# Altium schematic sheet UpStream.SchDoc
size A; SheetNumber: 4; SheetTotal: 4
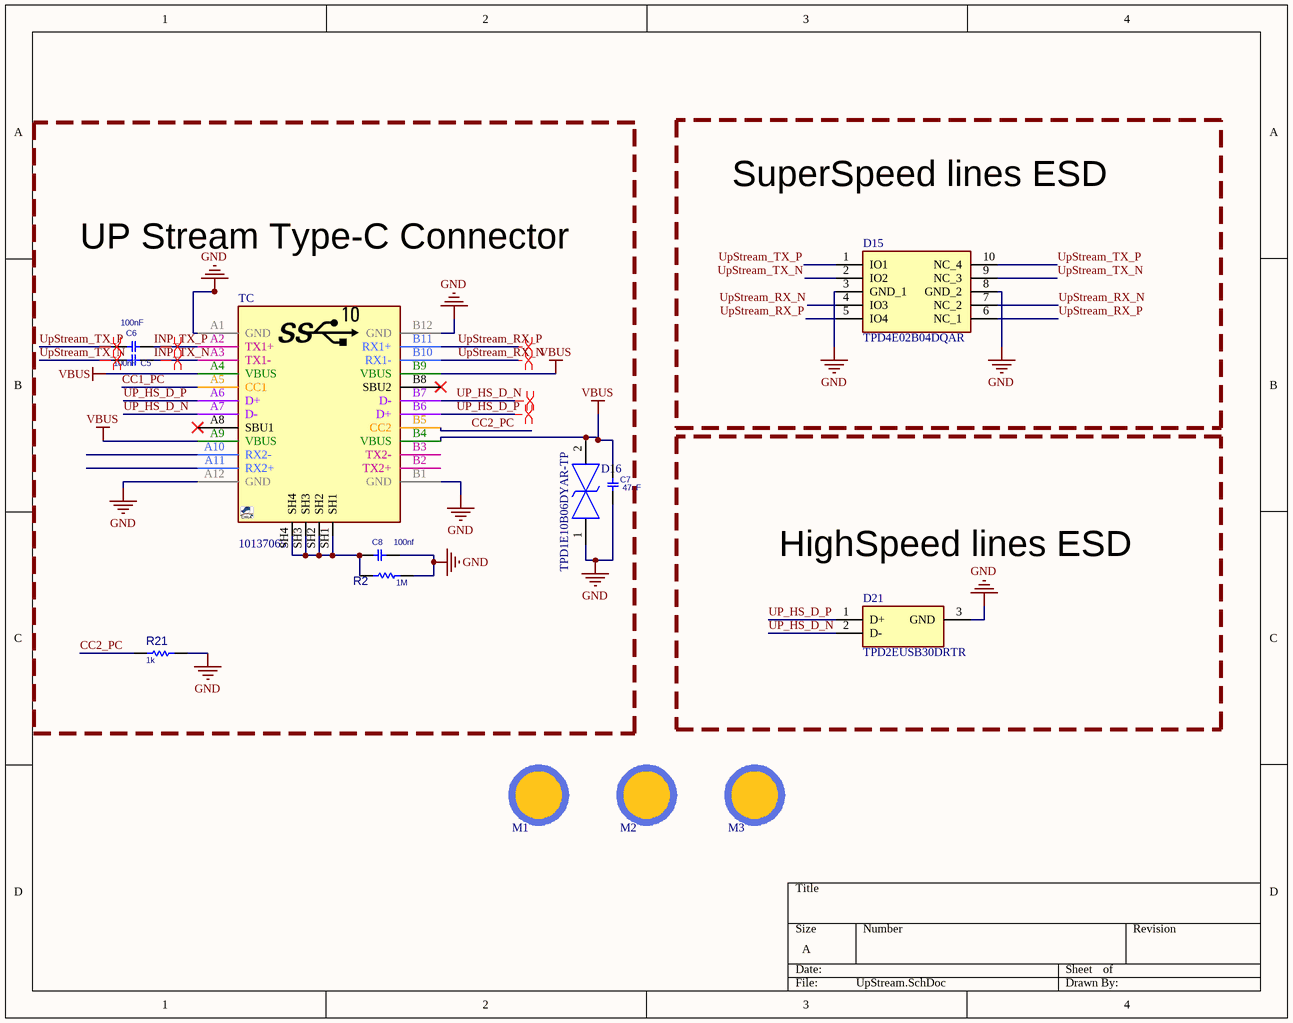
[diagram p0: UpStream.SchDoc]

## Parts
C5  100nF  [C0402]
C6  100nF  [C0402]
C7  47uF  [C0805]
C8  100nf  [C1812]
D15  TPD4E02B04DQAR  [DQA(R-PUSON-N10)]
D16  TPD1E10B06DYAR-TP  [SODFL1608X77N]
D21  TPD2EUSB30DRTR  [SOTFL35P100X50-3N]
M1  DNP/MH  [PSPMH2]  (value not drawn)  (no BOM)
M2  DNP/MH  [PSPMH2]  (value not drawn)  (no BOM)
M3  DNP/MH  [PSPMH2]  (value not drawn)  (no BOM)
R2  1M  [R0805]
R21  1k  [R0402]
TC  10137065  [USBC_HYB_UJ31CHG2SMT]

## Blocks framed on the sheet
UP Stream Type-C Connector: C5-C8 D16 R2 R21 TC
SuperSpeed lines ESD: D15
HighSpeed lines ESD: D21

## Nets
GND: C7.1 C8.2 D15.3(GND_1) D15.8(GND_2) D16.1 D21.3(GND) R2.1 R21.2 TC.A1(GND) TC.A12(GND) TC.B1(GND) TC.B12(GND)
VBUS: C7.2 D16.2 TC.A4(VBUS) TC.A9(VBUS) TC.B4(VBUS) TC.B9(VBUS)
CC1_PC: TC.A5(CC1)
CC2_PC: R21.1 TC.B5(CC2)
INP_TX_N: C5.2 TC.A3(TX1-)
INP_TX_P: C6.2 TC.A2(TX1+)
UP_HS_D_N: D21.2(D-) TC.A7(D-) TC.B7(D-)
UP_HS_D_P: D21.1(D+) TC.A6(D+) TC.B6(D+)
UpStream_RX_N: D15.4(IO3) D15.7(NC_2) TC.B10(RX1-)
UpStream_RX_P: D15.5(IO4) D15.6(NC_1) TC.B11(RX1+)
UpStream_TX_N: C5.1 D15.2(IO2) D15.9(NC_3)
UpStream_TX_P: C6.1 D15.1(IO1) D15.10(NC_4)
NetC8_1: C8.1 R2.2 TC.SH1 TC.SH2 TC.SH3 TC.SH4

Not connected (* = marked no-connect by the designer): TC A8(SBU1)* A10(RX2-) A11(RX2+) B2(TX2+) B3(TX2-) B8(SBU2)*

## Layout directives
differential pair; net class SupperSpeed; rule Differential Pairs Routing [Pref Gap = 5mil    Min Gap  = 5mil    Max Gap  = 5milPref Width = 4.347mil    Min Width  = 2.255mil    Max Width  = 4.347mil]: INP_TX_N, INP_TX_P, UpStream_RX_P, UpStream_TX_N, UpStream_TX_P
differential pair; net class SupperSpeed; rule Differential Pairs Routing [Pref Gap = 5mil    Min Gap  = 5mil    Max Gap  = 5milPref Width = 4.347mil    Min Width  = 2.255mil    Max Width  = 4.347mil]; rule Differential Pairs Routing [Pref Gap = 5mil    Min Gap  = 5mil    Max Gap  = 5milPref Width = 4.347mil    Min Width  = 2.255mil    Max Width  = 4.347mil]: UpStream_RX_N
differential pair: UP_HS_D_N, UP_HS_D_P

## Library data of the parts
C5 C6 = CAP_SMD_MLCC_0402
C7 = CAP_SMD_MLCC_0805
C8 = CAP_SMD_MLCC_1812: +1kv 100nf
D15 = TPD4E02B04DQAR: Diode; Manufacturer_Name: Texas Instruments; Datasheet Link: http://www.ti.com/lit/gpn/tpd4e02b04; Manufacturer_Part_Number: TPD4E02B04DQAR; Mouser Part Number: 595-TPD4E02B04DQAR; Mouser Price/Stock: https://www.mouser.co.uk/ProductDetail/Texas-Instruments/TPD4E02B04DQAR?qs=8%2FmU9qzJpL%2FFVYtHO1iV9g%3D%3D; Arrow Part Number: TPD4E02B04DQAR; Arrow Price/Stock: https://www.arrow.com/en/products/tpd4e02b04dqar/texas-instruments?utm_currency=USD&region=nac
D16 = TPD1E10B06DYARQ1: TVS Diode (Bi-directional); Manufacturer_Name: Texas Instruments; Datasheet Link: https://www.ti.com/lit/ds/symlink/tpd1e10b06-q1.pdf?ts=1647960520558&ref_url=https%253A%252F%252Fwww.ti.com%252Fstore%252Fti%252Fen%252Fp%252Fproduct%252F%253Fp%253DTPD1E10B06DYARQ1%2526keyMatch%253DTPD1E10B06DYARQ1%2526tisearch%253Dsearch-everything%2526; Height: 0.77mm; Manufacturer_Part_Number: TPD1E10B06DYARQ1; Mouser Part Number: 595-TPD1E10B06DYARQ1; Mouser Price/Stock: https://www.mouser.co.uk/ProductDetail/Texas-Instruments/TPD1E10B06DYARQ1?qs=MyNHzdoqoQLC7lMK0t36jg%3D%3D; Arrow Part Number: TPD1E10B06DYARQ1; Arrow Price/Stock: https://www.arrow.com/en/products/tpd1e10b06dyarq1/texas-instruments.html?utm_currency=USD&region=nac
D21 = TPD2EUSB30DRTR: TPD2EUSB30ADRTR; Manufacturer_Name: Texas Instruments; Datasheet Link: https://datasheet.datasheetarchive.com/originals/distributors/SFDatasheet-11/sf-000234749.pdf; Height: 0.5mm; Manufacturer_Part_Number: TPD2EUSB30DRTR; Mouser Part Number: 595-TPD2EUSB30DRTR; Mouser Price/Stock: https://www.mouser.co.uk/ProductDetail/Texas-Instruments/TPD2EUSB30DRTR?qs=%2Fqzd9s%252BcLd6bPJi5HXCDvw%3D%3D; Arrow Part Number: TPD2EUSB30DRTR; Arrow Price/Stock: https://www.arrow.com/en/products/tpd2eusb30drtr/texas-instruments?utm_currency=USD&region=nac
M1-M3 = PSPMH2: Plastic Spacer mouting, Hole 2mm; ASSEMBLY: DNP; VALUE: DNP/MH
R2 R21 = RES_SMD_0402: RESISTOR, SMD
TC = CONN_USBC_SMD_10137065: CONN, USB, Type C, USB 3.1 Gen 1, Right-Angle, SMD; MANF: Amphenol; MANF_P#: 10137065-00021LF; PARAM: 5A; Price: None; Value: 10137065